# EAGLE design ThermalCamera (EAGLE 9.6.2)
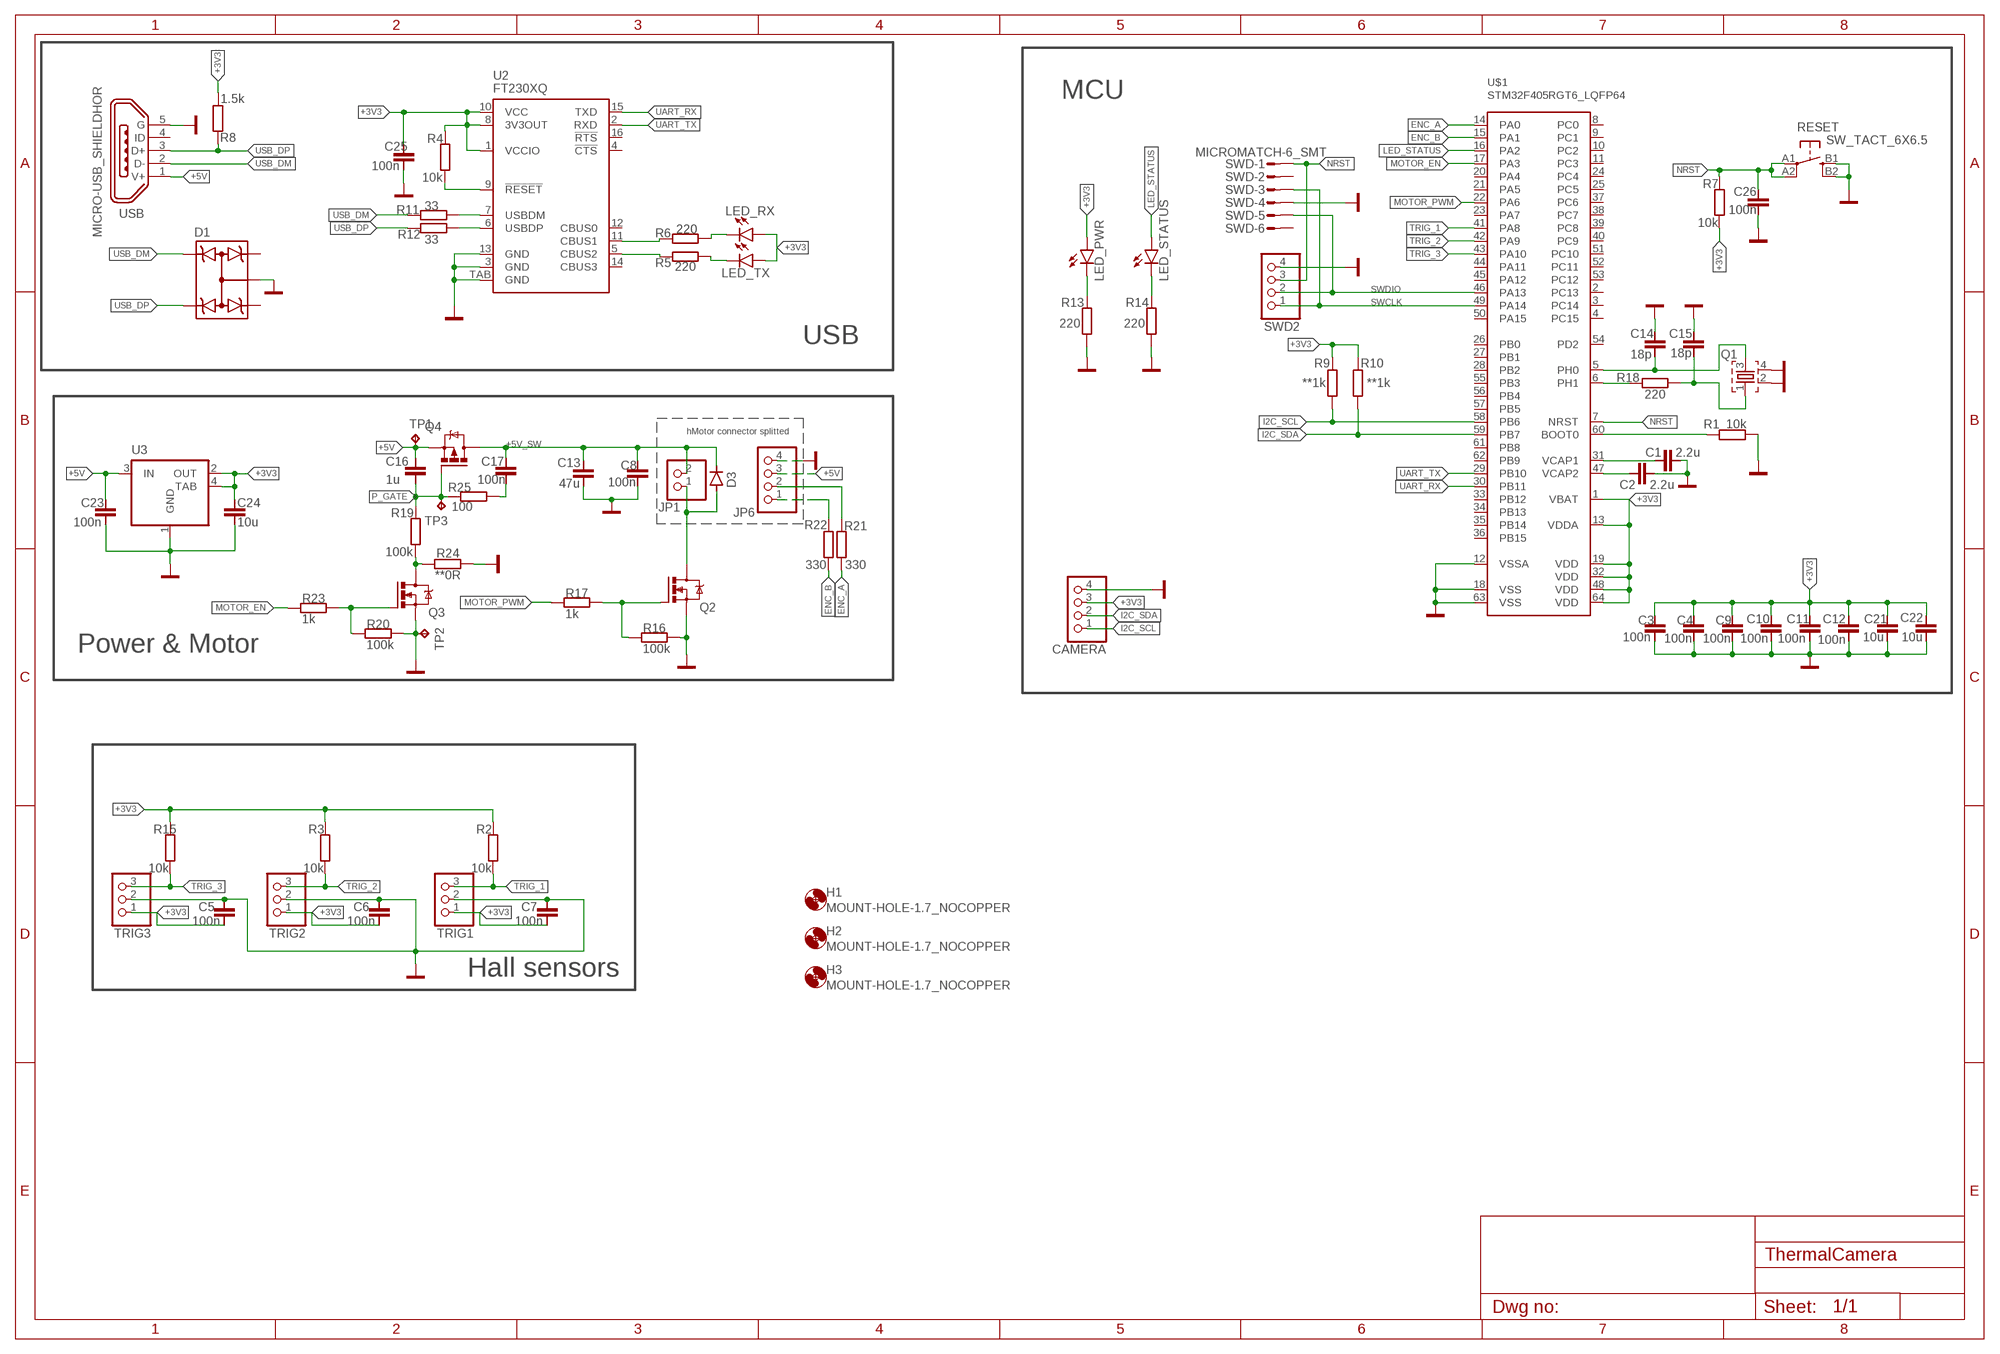
[diagram p0: schematic, sheet 1]

## Parts
C1  2.2u  CAP_H-0603  [0603]
C2  2.2u  CAP_H-0603  [0603]
C3  100n  CAP_H-0603  [0603]
C4  100n  CAP_H-0603  [0603]
C5  100n  CAP_H-0603  [0603]
C6  100n  CAP_H-0603  [0603]
C7  100n  CAP_H-0603  [0603]
C8  100n  CAP_H-0603  [0603]
C9  100n  CAP_H-0603  [0603]
C10  100n  CAP_H-0603  [0603]
C11  100n  CAP_H-0603  [0603]
C12  100n  CAP_H-0603  [0603]
C13  47u  CAP_H-0805  [0805]
C14  18p  CAP_H-0603  [0603]
C15  18p  CAP_H-0603  [0603]
C16  1u  CAP_H-0603  [0603]
C17  100n  CAP_H-0603  [0603]
C21  10u  CAP_H-0603  [0603]
C22  10u  CAP_H-0603  [0603]
C23  100n  CAP_H-0603  [0603]
C24  10u  CAP_H-0603  [0603]
C25  100n  CAP_H-0603  [0603]
C26  100n  CAP_H-0603  [0603]
CAMERA  PINHD-1X4  [1X04]
D1  TRANSIL-4  [SOT323-5]
D3  BAR63-03  [SOD323]
H1  MOUNT-HOLE-1.7_NOCOPPER  [1.7-NO_COPPER]
H2  MOUNT-HOLE-1.7_NOCOPPER  [1.7-NO_COPPER]
H3  MOUNT-HOLE-1.7_NOCOPPER  [1.7-NO_COPPER]
JP1  PINHD-1X2  [1X02]
JP6  PINHD-1X4  [1X04]
LED_PWR  LEDCHIPLED_0603  [CHIPLED_0603]
LED_RX  LEDCHIPLED_0603  [CHIPLED_0603]
LED_STATUS  LEDCHIPLED_0603  [CHIPLED_0603]
LED_TX  LEDCHIPLED_0603  [CHIPLED_0603]
Q1  CRYSTAL_4PIN-5X3.2  [CRYSTAL_5X3.2_4PIN]
Q2  NMOS-SOT23  [SOT23]
Q3  NMOS-SOT23  [SOT23]
Q4  PMOS-SOT23  [SOT23]
R1  10k  RES_H-0603  [0603]
R2  10k  RES_H-0603  [0603]
R3  10k  RES_H-0603  [0603]
R4  10k  RES_H-0603  [0603]
R5  220  RES_H-0603  [0603]
R6  220  RES_H-0603  [0603]
R7  10k  RES_H-0603  [0603]
R8  1.5k  RES_H-0603  [0603]
R9  **1k  RES_H-0603  [0603]
R10  **1k  RES_H-0603  [0603]
R11  33  RES_H-0603  [0603]
R12  33  RES_H-0603  [0603]
R13  220  RES_H-0603  [0603]
R14  220  RES_H-0603  [0603]
R15  10k  RES_H-0603  [0603]
R16  100k  RES_H-0603  [0603]
R17  1k  RES_H-0603  [0603]
R18  220  RES_H-0603  [0603]
R19  100k  RES_H-0603  [0603]
R20  100k  RES_H-0603  [0603]
R21  330  RES_H-0603  [0603]
R22  330  RES_H-0603  [0603]
R23  1k  RES_H-0603  [0603]
R24  **0R  RES_H-0603  [0603]
R25  100  RES_H-0603  [0603]
RESET  SW_TACT_6X6.5  [SW_TACT_6X6.5]
SWD  MICROMATCH-6_SMT  [MICROMATCH-6_SMT]
SWD2  PINHD-1X4  [1X04]
TP1  TPTP12R  [TP12R]
TP2  TPTP12R  [TP12R]
TP3  TPTP06R  [TP06R]
TRIG1  PINHD-1X3  [1X03]
TRIG2  PINHD-1X3  [1X03]
TRIG3  PINHD-1X3  [1X03]
U2  FT230XQ  [QFN16]
U3  REG1117  [SOT223]
U$1  STM32F405RGT6_LQFP64  STM32F40XXX_LQFP64  [SQFP-S-10X10-64]
USB  MICRO-USB_SHIELDHOR  [MICRO_USB_6_SHIELD]

## Nets
+3V3 [POWER]: C3.1 C4.1 C5.2 C6.2 C7.2 C9.1 C10.1 C11.1 C12.1 C21.1 C22.1 C24.1 C25.1 CAMERA.3 LED_PWR.A LED_RX.A LED_TX.A R2.2 R3.2 R4.2 R7.1 R8.1 R9.2 R10.2 R15.2 TRIG1.1 TRIG2.1 TRIG3.1 U2.1(VCCIO) U2.8(3V3OUT) U2.10(VCC) U3.2(OUT) U3.4(TAB) U$1.1(VBAT) U$1.13(VDDA) U$1.19(VDD) U$1.32(VDD) U$1.48(VDD) U$1.64(VDD)
+5V [POWER]: C16.1 C23.1 JP6.3 Q4.2(S) TP1.TP U3.3(IN) USB.1(V+)
+5V_SW [POWER]: C8.1 C13.1 C17.1 D3.1(C) JP1.2 Q4.3(D)
ENC_A: R21.2 U$1.14(PA0)
ENC_B: R22.1 U$1.15(PA1)
GND: C1.2 C2.2 C3.2 C4.2 C5.1 C6.1 C7.1 C8.2 C9.2 C10.2 C11.2 C12.2 C13.2 C14.1 C15.1 C21.2 C22.2 C23.2 C24.2 C25.2 C26.2 CAMERA.4 D1.2 JP6.4 Q1.2 Q1.4 Q2.2(S) Q3.2(S) R1.2 R13.2 R14.2 R16.1 R20.1 R24.1 RESET.B1(S) RESET.B2(S1) SWD2.4 SWD.P$4 TP2.TP TRIG1.2 TRIG2.2 TRIG3.2 U2.3(GND) U2.13(GND) U2.TAB(GND) U3.1(GND) U$1.12(VSSA) U$1.18(VSS) U$1.63(VSS) USB.5(G)
I2C_SCL: CAMERA.1 R9.1 U$1.58(PB6)
I2C_SDA: CAMERA.2 R10.1 U$1.59(PB7)
LED_STATUS: LED_STATUS.A U$1.16(PA2)
MOTOR_EN: R23.2 U$1.17(PA3)
MOTOR_PWM: R17.2 U$1.22(PA6)
N$1: R1.1 U$1.60(BOOT0)
N$2: C1.1 U$1.31(VCAP1)
N$3: C2.1 U$1.47(VCAP2)
N$4: D3.2(A) JP1.1 Q2.3(D)
N$5: R4.1 U2.9(!RESET)
N$6: R6.2 U2.11(CBUS1)
N$7: R5.2 U2.5(CBUS2)
N$8: LED_RX.C R6.1
N$9: LED_TX.C R5.1
N$11: Q3.3(D) R19.1 R24.2
N$13: R11.1 U2.7(USBDM)
N$14: R12.1 U2.6(USBDP)
N$15: LED_PWR.C R13.1
N$16: LED_STATUS.C R14.1
N$17: Q2.1(G) R16.2 R17.1
N$18: R18.1 U$1.6(PH1)
N$19: C15.2 Q1.1 R18.2
N$21: JP6.2 R21.1
N$22: C17.2 R25.1
N$23: Q3.1(G) R20.2 R23.1
N$24: JP6.1 R22.2
NRST: C26.1 R7.2 RESET.A1(P) RESET.A2(P1) SWD2.3 SWD.P$1 U$1.7(NRST)
OSC_IN: C14.2 Q1.3 U$1.5(PH0)
P_GATE: C16.2 Q4.1(G) R19.2 R25.2 TP3.TP
SWCLK: SWD2.1 SWD.P$3 U$1.49(PA14)
SWDIO: SWD2.2 SWD.P$5 U$1.46(PA13)
TRIG_1: R2.1 TRIG1.3 U$1.41(PA8)
TRIG_2: R3.1 TRIG2.3 U$1.42(PA9)
TRIG_3: R15.1 TRIG3.3 U$1.43(PA10)
UART_RX: U2.15(TXD) U$1.30(PB11)
UART_TX: U2.2(RXD) U$1.29(PB10)
USB_DM: D1.4 R11.2 USB.2(D-)
USB_DP: D1.5 R8.2 R12.2 USB.3(D+)
Unconnected: D1.1 D1.3 SWD.P$2 SWD.P$6 U2.4(!CTS) U2.12(CBUS0) U2.14(CBUS3) U2.16(!RTS) U$1.2(PC13) U$1.3(PC14) U$1.4(PC15) U$1.8(PC0) U$1.9(PC1) U$1.10(PC2) U$1.11(PC3) U$1.20(PA4) U$1.21(PA5) U$1.23(PA7) U$1.24(PC4) U$1.25(PC5) U$1.26(PB0) U$1.27(PB1) U$1.28(PB2) U$1.33(PB12) U$1.34(PB13) U$1.35(PB14) U$1.36(PB15) U$1.37(PC6) U$1.38(PC7) U$1.39(PC8) U$1.40(PC9) U$1.44(PA11) U$1.45(PA12) U$1.50(PA15) U$1.51(PC10) U$1.52(PC11) U$1.53(PC12) U$1.54(PD2) U$1.55(PB3) U$1.56(PB4) U$1.57(PB5) U$1.61(PB8) U$1.62(PB9) USB.4(ID) USB.M1(S1) USB.M2(S2) USB.M3(S3) USB.M4(S4) USB.M5(S5) USB.M6(S6)

## Notes on the sheet
- MCU
- USB
- hMotor connector splitted
- Power & Motor
- Hall sensors

## Library data of the parts
C1-C17 C21-C26 = hsrn_rcl:CAP_H
CAMERA JP6 = pinhead:PINHD-1X4: PIN HEADER; SPICEPREFIX: E
D1 = hsrn_diody:TRANSIL-4
D3 = hsrn_diody:BAR63-03: DIODE controlled avalanche rectifier
H1-H3 = hsrn_pads+holes:MOUNT-HOLE
JP1 = pinhead:PINHD-1X2: PIN HEADER
LED_PWR LED_RX LED_STATUS LED_TX = hsrn_diody:LED: LED OSRAM: - CHIPLED LG R971, LG N971, LY N971, LG Q971, LY Q971, LO R971, LY R971 LH N974, LH R974 LS Q976, LO Q976, LY Q976 LO Q996 - Hyper CHIPLED LW Q18S LB Q993, LB Q99A, LB R99A - SideLED LS A670, LO A670, LY A670, LG A670, LP A670 LB A673, LV A673, LT A673, LW A673 LH A674 LY A675 LS A676, LA A676, LO A676, LY A676, LW A676 LS A679, LY A679, LG A679 - Hyper Micro SIDELED® LS Y876, LA Y876, LO Y876, LY Y876 LT Y87S - SmartLED LW L88C, LW L88S LB L89C, LB L89S, LG L890 LS L89K, LO L89K, LY L89K LS L896, LA L896, LO L896, LY L896 - TOPLED LS T670, LO T670, LY T670, LG T670, LP T670 LSG T670, LSP T670, LSY T670, LOP T670, LYG T670 LG T671, LOG T671, LSG T671 LB T673, LV T673, LT T673, LW T673 LH T674 LS T676, LA T676, LO T676, LY T676, LB T676, LH T676, LSB T676, LW T676 LB T67C, LV T67C, LT T67C, LS T67K, LO T67K, LY T67K, LW E67C LS E67B, LA E67B, LO E67B, LY E67B, LB E67C, LV E67C, LT E67C LW T67C LS T679, LY T679, LG T679 LS T770, LO T770, LY T770, LG T770, LP T770 LB T773, LV T773, LT T773, LW T773 LH T774 LS E675, LA E675, LY E675, LS T675 LS T776, LA T776, LO T776, LY T776, LB T776 LHGB T686 LT T68C, LB T68C - Hyper Mini TOPLED® LB M676 - Mini TOPLED Santana® LG M470 LS M47K, LO M47K, LY M47K Source: http://www.osram.convergy.de LUXEON: - LUMILED® LXK2-PW12-R00, LXK2-PW12-S00, LXK2-PW14-U00, LXK2-PW14-V00 LXK2-PM12-R00, LXK2-PM12-S00, LXK2-PM14-U00 LXK2-PE12-Q00, LXK2-PE12-R00, LXK2-PE12-S00, LXK2-PE14-T00, LXK2-PE14-U00 LXK2-PB12-K00, LXK2-PB12-L00, LXK2-PB12-M00, LXK2-PB14-N00, LXK2-PB14-P00, LXK2-PB14-Q00 LXK2-PR12-L00, LXK2-PR12-M00, LXK2-PR14-Q00, LXK2-PR14-R00 LXK2-PD12-Q00, LXK2-PD12-R00, LXK2-PD12-S00 LXK2-PH12-R00, LXK2-PH12-S00 LXK2-PL12-P00, LXK2-PL12-Q00, LXK2-PL12-R00 Source: www.luxeon.com KINGBRIGHT: KA-3528ASYC Source: www.kingbright.com
Q1 = hsrn_pasywne:CRYSTAL_4PIN
Q2 Q3 = hsrn_tranzystory_scr:NMOS
Q4 = hsrn_tranzystory_scr:PMOS
R1-R25 = hsrn_rcl:RES_H
RESET = hsrn_switche:SW_TACT_6X6.5
SWD = hsrn_zlacza_idc:MICROMATCH-6: MicroMaTch 6 7-215464-6 / 0-215464-6 Drawing Number C-215464 DDEController.pdf
SWD2 = pinhead:PINHD-1X4: PIN HEADER
TP1-TP3 = hsrn_pads+holes:TP: Test pad
TRIG1-TRIG3 = pinhead:PINHD-1X3: PIN HEADER
U2 = hsrn_IC_digital:FT230X: USB to BASIC UART IC Auto generated by make-symbol-device-package-bsdl.ulp Rev. 43 Source: Data sheet <http://www.ftdichip.com/Support/Documents/DataSheets/ICs/DS_FT230X.pdf>
U3 = hsrn_IC_power_mgmt:REG1117: 800mA and 1A Low Dropout (LDO) Positive Regulator 1.8V, 2.5V, 2.85V, 3.3V, 5V, and Adj; MPN: REG1117; OC_FARNELL: 1097566; OC_NEWARK: 14P6981
U$1 = hsrn_stm32:STM32F40XXX_LQFP64
USB = hsrn_zlacza:MICRO-USB_SHIELD: Micro USB connector with shield connection.

## Board
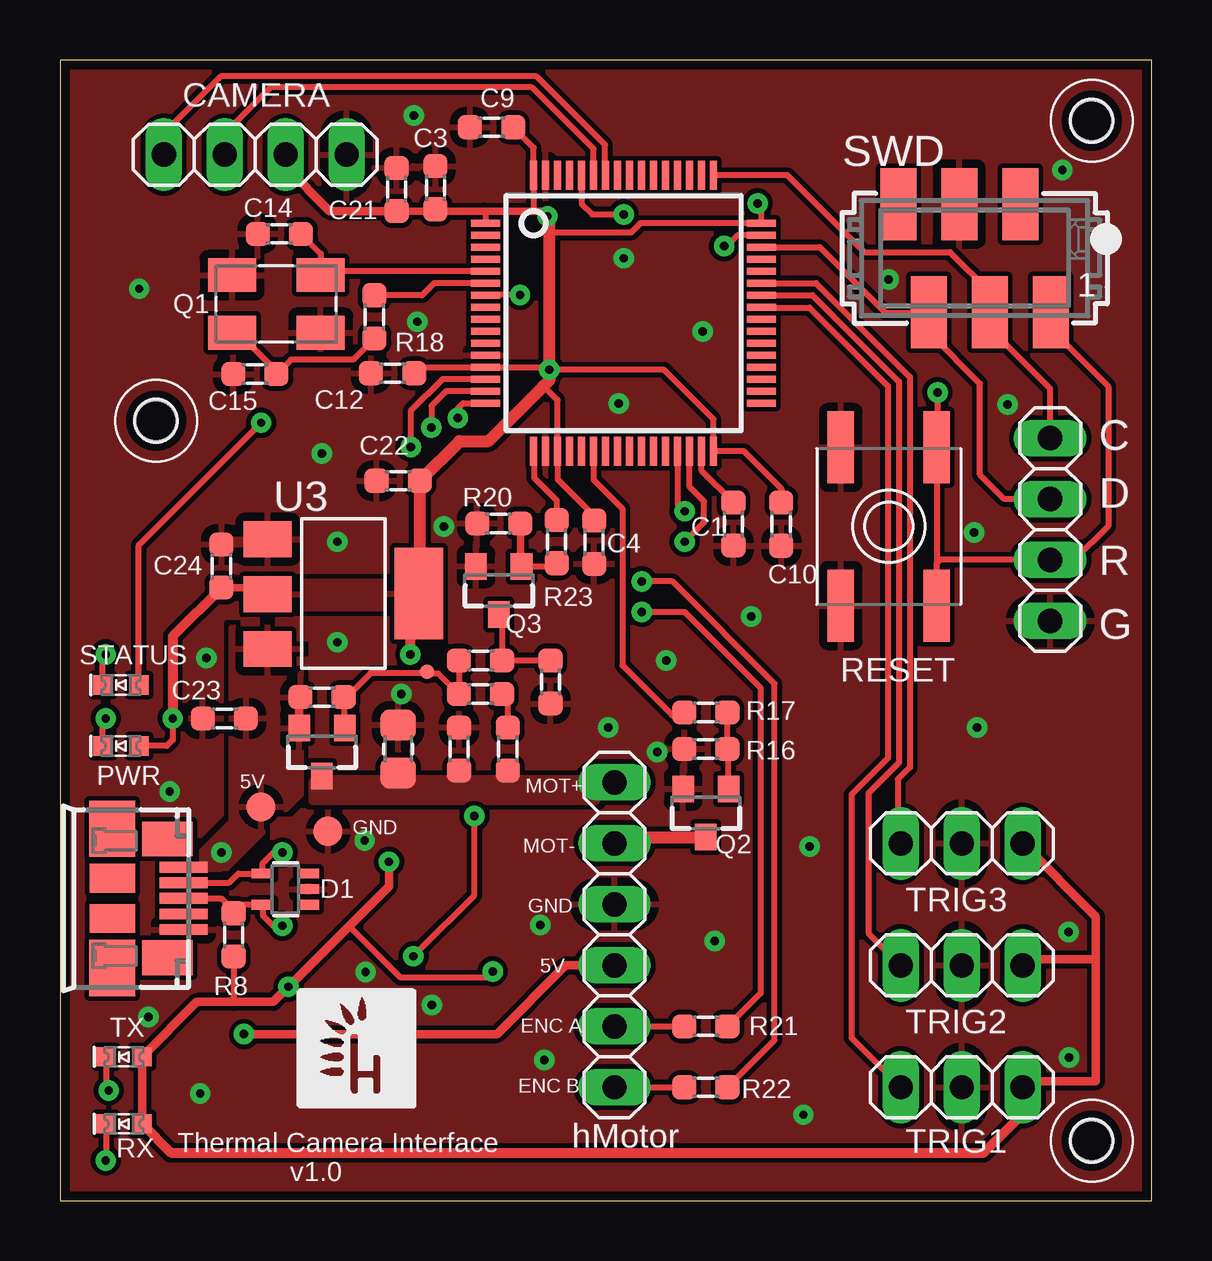
[diagram p1: board, top side]
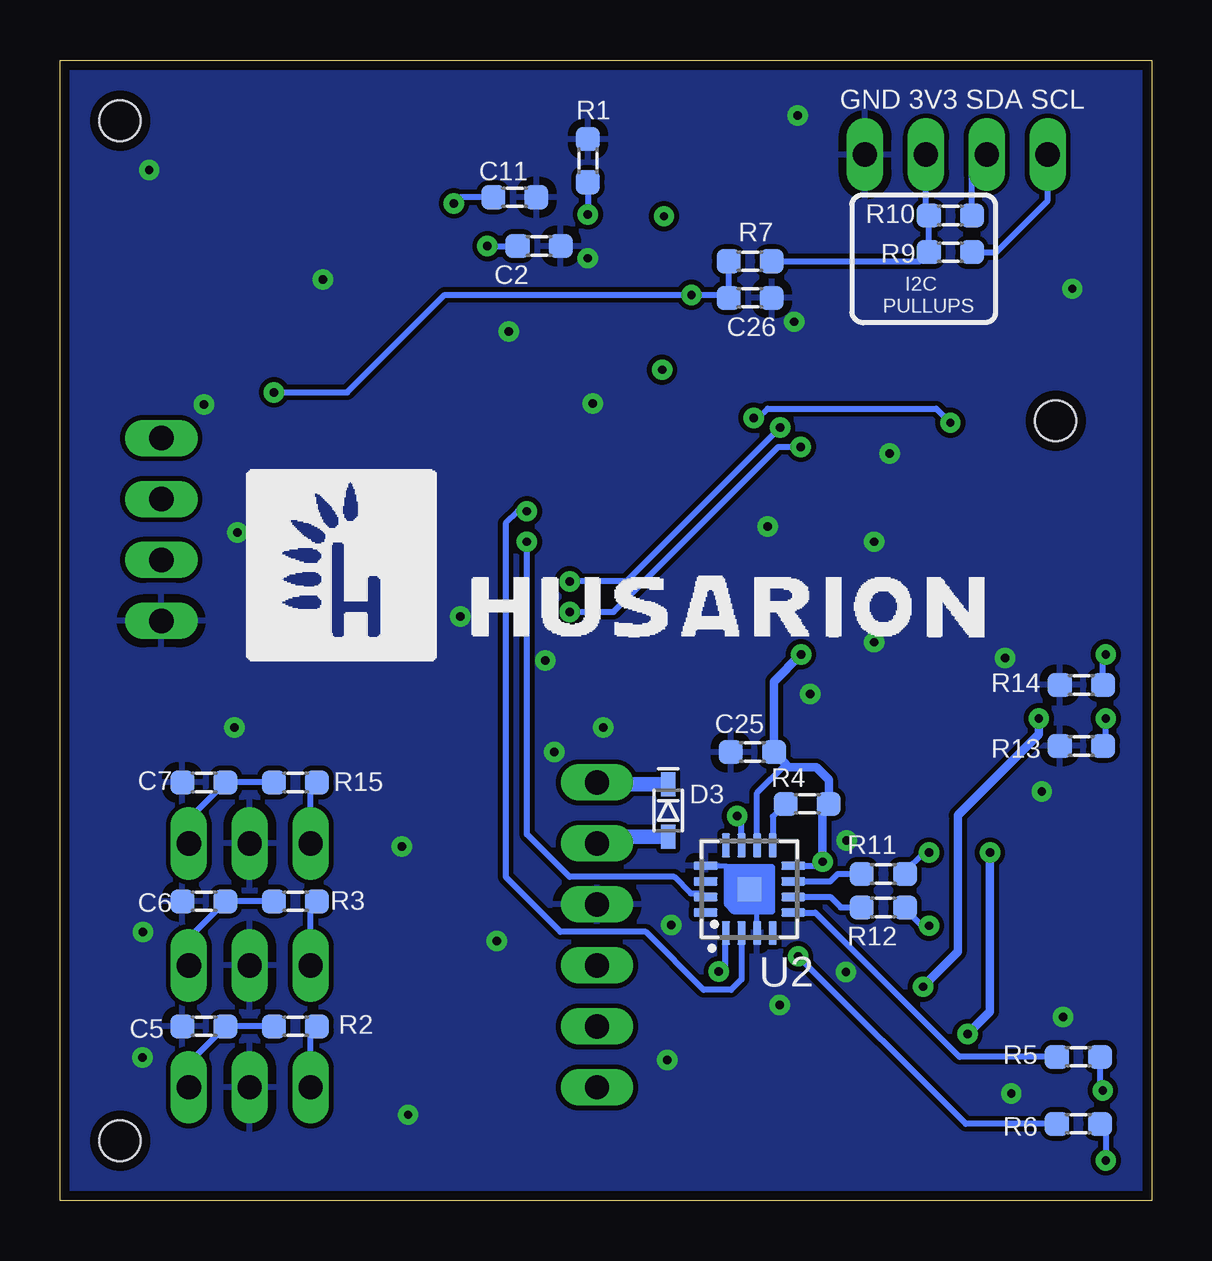
[diagram p2: board, bottom side, seen from below]

Size 45.5 x 47.53 mm. Coordinates in mm from the lower left corner, seen from the top.
Outline: 0,0 45.5,0 45.5,47.53 0,47.53 0,0
Copper layers (1*16): Top 0.035mm / dielectric 1.45mm / Bottom 0.035mm
Design rules "hsrn_2-layer-35um-cost-effective": minimum track width 0.2mm, minimum drill 0.35mm, track to track 0.2mm, track to pad 0.2mm, pad to pad 0.2mm, via to via 0.2mm, smd to smd 0.2mm, copper to edge 0.4mm, drill to drill 0.3mm, minimum pad ring 0.25mm, minimum via ring 0.25mm, stop-mask expansion 0.1mm, vias tented up to drill 0.4mm, thermal gap 0.35mm

### Footprints (pad centres in the part's own frame; a part is rotated, then mirrored left to right if it is on the bottom)
0603 = smd 1 x 1: 1 -0.9,0; 2 0.9,0
0805 = smd 1.3 x 1.5: 1 -1,0; 2 1,0
1X04 = drill 1.016 long: 1 -3.81,0; 2 -1.27,0; 3 1.27,0; 4 3.81,0
SOT323-5 = smd 0.4 x 0.9: 1 -0.65,-0.95; 2 0,-0.95; 3 0.65,-0.95; 4 0.65,0.95; 5 -0.65,0.95
SOD323 = smd 1 x 0.6: 1 -1.1,0; 2 1.1,0
1.7-NO_COPPER = hole 1.7: 0,0
1X02 = drill 1.016 long: 1 -1.27,0; 2 1.27,0
CHIPLED_0603 = smd 0.8 x 0.8: A 0,-0.75; C 0,0.75
CRYSTAL_5X3.2_4PIN = smd 2 x 1.4: 1 -1.85,-1.2; 2 1.85,-1.2; 3 1.85,1.2; 4 -1.85,1.2
SOT23 = smd 0.9 x 1.1: 1 -0.95,-1; 2 0.95,-1; 3 0,1
SW_TACT_6X6.5 = smd 3 x 1.1: A1 -3.3,2; A2 3.3,2; B1 -3.3,-2; B2 3.3,-2
MICROMATCH-6_SMT = smd 1.5 x 3: P$1 3.195,-2.25; P$2 1.925,2.25; P$3 0.655,-2.25; P$4 -0.615,2.25; P$5 -1.885,-2.25; P$6 -3.155,2.25
TP12R = smd 1.2 x 1.2: TP 0,0
TP06R = smd 0.6 x 0.6: TP 0,0
1X03 = drill 1.016 long: 1 -2.54,0; 2 0,0; 3 2.54,0
QFN16 = smd 1 x 0.35: 1 -1.825,0.975; 2 -1.825,0.325; 3 -1.825,-0.325; 4 -1.825,-0.975; 9 1.825,-0.975; 10 1.825,-0.325; 11 1.825,0.325; 12 1.825,0.975 | smd 0.35 x 1: 5 -0.975,-1.825; 6 -0.325,-1.825; 7 0.325,-1.825; 8 0.975,-1.825; 13 0.975,1.825; 14 0.325,1.825; 15 -0.325,1.825; 16 -0.975,1.825 | smd 1 x 1: TAB 0,0
SOT223 = smd 1.499 x 2.007: 1 -2.261,-3.15; 2 0.025,-3.15; 3 2.311,-3.15 | smd 3.81 x 2.007: 4 0,3.15
SQFP-S-10X10-64 = smd 0.3 x 1.2: 1 -3.75,-5.75; 2 -3.25,-5.75; 3 -2.75,-5.75; 4 -2.25,-5.75; 5 -1.75,-5.75; 6 -1.25,-5.75; 7 -0.75,-5.75; 8 -0.25,-5.75; 9 0.25,-5.75; 10 0.75,-5.75; 11 1.25,-5.75; 12 1.75,-5.75; 13 2.25,-5.75; 14 2.75,-5.75; 15 3.25,-5.75; 16 3.75,-5.75; 33 3.75,5.75; 34 3.25,5.75; 35 2.75,5.75; 36 2.25,5.75; 37 1.75,5.75; 38 1.25,5.75; 39 0.75,5.75; 40 0.25,5.75; 41 -0.25,5.75; 42 -0.75,5.75; 43 -1.25,5.75; 44 -1.75,5.75; 45 -2.25,5.75; 46 -2.75,5.75; 47 -3.25,5.75; 48 -3.75,5.75 | smd 1.2 x 0.3: 17 5.75,-3.75; 18 5.75,-3.25; 19 5.75,-2.75; 20 5.75,-2.25; 21 5.75,-1.75; 22 5.75,-1.25; 23 5.75,-0.75; 24 5.75,-0.25; 25 5.75,0.25; 26 5.75,0.75; 27 5.75,1.25; 28 5.75,1.75; 29 5.75,2.25; 30 5.75,2.75; 31 5.75,3.25; 32 5.75,3.75; 49 -5.75,3.75; 50 -5.75,3.25; 51 -5.75,2.75; 52 -5.75,2.25; 53 -5.75,1.75; 54 -5.75,1.25; 55 -5.75,0.75; 56 -5.75,0.25; 57 -5.75,-0.25; 58 -5.75,-0.75; 59 -5.75,-1.25; 60 -5.75,-1.75; 61 -5.75,-2.25; 62 -5.75,-2.75; 63 -5.75,-3.25; 64 -5.75,-3.75
MICRO_USB_6_SHIELD = smd 2 x 0.45: 1 1.975,1.3; 2 1.975,0.65; 3 1.975,0; 4 1.975,-0.65; 5 1.975,-1.3 | smd 2.1 x 1.45: M1 1.3,2.475; M2 1.3,-2.475 | smd 1.9 x 2.35: M3 -1,2.9; M6 -1,-2.9 | smd 1.9 x 1.2: M4 -0.988,0.838; M5 -0.988,-0.838

### Placement (x,y rotation side)
C1  28.07,28.19 270 top
C2  25.53,39.78 0 bottom
C3  15.65,42.21 90 top
C4  22.26,27.44 270 top
C5  39.5,7.27 0 bottom
C6  39.5,12.47 0 bottom
C7  39.5,17.43 0 bottom
C8  16.64,18.82 90 top
C9  17.99,44.73 180 top
C10  30.07,28.19 270 top
C11  26.54,41.81 0 bottom
C12  13.86,34.48 180 top
C13  14.1,18.82 90 top
C14  9.14,40.29 0 top
C15  8.13,34.44 0 top
C16  10.92,20.98 0 top
C17  18.67,18.82 90 top
C21  14.03,42.14 90 top
C22  14.1,30 180 top
C23  6.86,20.09 180 top
C24  6.73,26.44 90 top
C25  16.64,18.7 180 bottom
C26  16.73,37.62 0 bottom
CAMERA  8.14,43.59 0 top
D1  9.4,12.98 90 top
D3  20.15,16.26 270 bottom
H1  43,2.5 0 top
H2  4,32.5 0 top
H3  43,45 0 top
JP1  23.11,16.16 90 top
JP6  23.11,8.54 90 top
LED_PWR  2.54,18.95 90 top
LED_RX  2.67,3.2 90 top
LED_STATUS  2.54,21.49 90 top
LED_TX  2.67,6 90 top
Q1  9.02,37.37 0 top
Q2  26.92,16.16 180 top
Q3  18.29,25.43 180 top
Q4  10.92,18.7 180 top
R1  23.5,43.33 90 bottom
R2  35.69,7.27 180 bottom
R3  35.69,12.47 180 bottom
R4  14.35,16.54 0 bottom
R5  3.05,6 180 bottom
R6  3.05,3.2 180 bottom
R7  16.73,39.14 180 bottom
R8  7.24,11.08 90 top
R9  8.38,39.52 180 bottom
R10  8.38,41.05 180 bottom
R11  11.18,13.62 0 bottom
R12  11.18,12.22 0 bottom
R13  2.92,18.95 180 bottom
R14  2.92,21.49 180 bottom
R15  35.69,17.43 180 bottom
R16  26.92,18.82 0 top
R17  26.92,20.35 180 top
R18  13.11,36.83 270 top
R19  17.53,22.51 180 top
R20  18.29,28.22 0 top
R21  26.92,7.27 0 top
R22  26.92,4.73 180 top
R23  20.7,27.46 90 top
R24  20.45,21.62 90 top
R25  17.53,21.11 180 top
RESET  34.54,28.09 270 top
SWD  38.1,39.27 0 top
SWD2  41.27,27.97 270 top
TP1  8.38,16.41 0 top
TP2  11.18,15.39 0 top
TP3  15.3,22.04 0 top
TRIG1  37.59,4.73 180 top
TRIG2  37.59,9.81 180 top
TRIG3  37.59,14.89 180 top
U2  16.76,12.98 90 bottom
U3  11.81,25.3 270 top
U$1  23.5,36.98 270 top
U$2  [HUSARION_SYGNET_5MM]  12.43,6.4 0 top
U$3  [HUS_NAPIS_BOK_8MM]  37.72,22.51 0 bottom
USB  3.17,12.6 0 top

### Tracks (layer width: path | path; a pad name or v marks a point on that pad's centre or on a via)
+3V3  (via drill 0.35)
  Top 0.254: v18.03,9.55 17.78,9.3 14.2,9.3 12.05,11.45 | v29.08,41.56 29.25,41.39 U$1.48 24.2,40.73 23.81,40.34 20.54,40.34 20.4,40.2 | R8.1 7.24,8.28 | C9.1 19.75,43.88 U$1.64 19.75,41.28 19.7,41.24 | C10.1 30.07,29.67 28.5,31.23 U$1.32 27.25,32.55 25.18,34.62 v20.4,34.62 | 17.68,41.24 17.75,41.17 U$1.1 | C4.1 22.26,28.54 20.75,30.06 U$1.19 20.75,33.35 20.16,33.94 | C12.1 15.02,34.73 U$1.13 20.36,34.73 20.4,34.7 | v4.7,20.09 4.7,19.2 4.45,18.95 LED_PWR.A
  Top 0.305: C24.1 8.39,25.54 U3.2 | C21.1 15.58,41.24 17.68,41.24 19.7,41.24 20.1,41.24 v20.32,41.02
  Top 0.356: CAMERA.3 9.41,43.07 11.24,41.24 C21.1 | TRIG3.1 43.18,11.84 43.18,10.06 | 43.18,10.06 43.18,4.98 40.39,4.98 TRIG1.1 | TRIG2.1 40.39,10.06 43.18,10.06 | LED_RX.A LED_TX.A 5.7,8.28 7.24,8.28 8.89,8.28 v9.53,8.92 12.05,11.45 13.72,13.11 v13.72,14.12
  Top 0.406: 15.58,41.24 C3.1 | v14.61,22.76 14.61,24.94 U3.4 | C24.1 4.7,23.51 v4.7,20.09 | LED_RX.A 4.62,2 38.5,2 40.13,3.63 TRIG1.1
  Top 0.508: v20.32,41.02 20.4,40.94 20.4,40.2 20.4,34.7 v20.4,34.62 20.4,34.19 20.16,33.94 17.86,31.65 16.65,31.65 C22.1 15,25.34 U3.4
  Bottom 0.254: U2.10 16.44,16.99 15.23,18.19 | U2.1 17.78,11.12 17.78,9.81 v18.03,9.55 | v29.08,41.56 28.83,41.81 C11.1 | CAMERA.3 9.41,41.17 R10.2 R9.2 9.66,39.14 R7.1 | R15.2 C7.2 40.13,15.89 TRIG3.1 | R3.2 C6.2 40.13,10.94 TRIG2.1 | R2.2 C5.2 40.13,5.73 TRIG1.1 | U2.8 13.88,13.96 v13.72,14.12
  Bottom 0.356: v4.7,20.09 4.7,19.44 8.08,16.06 8.08,10.37 v9.53,8.92 | v14.61,22.76 15.74,21.63 C25.1 15.23,18.19 15.1,18.06 13.97,18.06 13.45,17.54 R4.2 13.72,16.27 v13.72,14.12
  pour Top: 9.53,25.81 14.22,25.81 14.22,24.66 9.53,24.66 9.4,24.79 9.4,25.68
+5V  (via drill 0.35)
  Top 0.356: v7.67,6.94 18.21,6.94 21.08,9.81 JP6.3 | Q4.2 9.97,20.93 C16.1
  Bottom 0.356: v6.73,14.51 6.73,7.88 v7.67,6.94
  pour Top: 5.97,14.62 7.17,15.82 7.17,23.9 10.03,23.9 10.03,16.92 6.96,13.84 5.97,13.84
  pour Top (no thermals): 5.9,13.8 5.9,14.6 6.4,14.6 6.7,14.3 6.7,13.8
+5V_SW
  Bottom 0.61: D3.1 23.04,17.36 JP1.2
  pour Top (no thermals): 10.54,17.43 10.54,16.66 22.35,16.66 22.35,18.06 21.84,17.55 10.67,17.55
ENC_A  (via drill 0.35)
  Top 0.254: U$1.14 15.95,34.23 14.62,32.91 v14.62,31.41 | R21.2 29.2,8.64 29.2,21.37 26.04,24.54 v24.26,24.54
  Bottom 0.254: v24.26,24.54 22.42,24.54 15.55,31.41 v14.62,31.41
ENC_B  (via drill 0.35)
  Top 0.254: U$1.15 16.1,33.73 15.49,33.12 v15.49,32.22 | R22.1 29.79,6.69 29.79,21.55 25.53,25.81 v24.26,25.81
  Bottom 0.254: v15.49,32.22 21.89,25.81 v24.26,25.81
GND  (via drill 0.35)
  Bottom 0.2: U2.13 17.74,13.96 U2.TAB 16.44,12.66 U2.3
  other vias: 24.89,18.7 22.86,19.71 25.27,22.51 23.5,39.27 26.8,36.22 38.1,27.84 39.5,33.17 30.99,3.58 20.19,5.87 15.49,8.16 12.74,9.54 5.84,4.47 4.57,17.05 6.1,22.62 11.56,27.46 10.92,31.14 27.3,10.81 31.24,14.76 38.23,19.71 42.06,5.97 42.04,11.2 41.78,42.95 14.76,45.22 3.3,38 28.81,24.34 3.68,7.65 16,28.09 34.54,38.38 14.22,21.11 11.56,23.27 12.7,15.01 20.02,11.49 14.9,36.62 23.3,33.22
  pour Top (rank 2): 0.13,47.78 45.59,47.78 45.72,47.65 45.72,0 0.13,0
  pour Bottom: 0,-0.1 0,47.65 0.25,47.91 45.85,47.91 45.85,0.15 45.72,0.03 0.13,0.03
I2C_SCL
  Top 0.254: U$1.58 22.73,42.75 22.73,43.99 19.86,46.85 6.69,46.85 4.33,44.48 CAMERA.1
  Bottom 0.254: R9.1 6.47,39.52 4.33,41.67 CAMERA.1
I2C_SDA
  Top 0.254: U$1.59 22.25,43.82 19.67,46.39 8.77,46.39 6.87,44.48 CAMERA.2
  Bottom 0.254: R10.1 7.48,42.97 CAMERA.2
LED_STATUS  (via drill 0.35)
  Top 0.254: v16.59,32.62 16.59,33.02 16.8,33.23 U$1.16 | v8.39,32.42 3.29,27.32 LED_STATUS.A
  Bottom 0.254: v16.59,32.62 16.38,32.62 16,33 8.97,33 v8.39,32.42
MOTOR_EN
  Top 0.254: U$1.17 19.77,31.21 19.77,30.12 20.7,29.18 R23.2
MOTOR_PWM
  Top 0.254: U$1.22 22.25,30.03 23.45,28.83 23.45,22.3 25.53,20.22 25.9,20.22 R17.2
N$1  (via drill 0.35)
  Top 0.254: U$1.60 21.75,41.53 22.18,41.09 v23.5,41.09
  Bottom 0.254: R1.1 v23.5,41.09
N$2
  Top 0.254: C1.1 26.75,30.42 U$1.31
N$3  (via drill 0.35)
  Top 0.254: U$1.47 28.27,40.23 27.81,39.78 v27.69,39.78
  Bottom 0.254: v27.69,39.78 C2.1
N$4
  Top 0.508: JP1.1 23.37,15.14 26.91,15.14 Q2.3
  Bottom 0.61: D3.2 22.84,15.16 JP1.1
N$5
  Bottom 0.254: R4.1 15.79,16 U2.9
N$6  (via drill 0.35)
  Top 0.254: v14.73,10.19 14.93,10.38 14.93,10.39 17.27,12.73 v17.27,16.03
  Bottom 0.254: v14.73,10.19 7.75,3.2 R6.2 | U2.11 17.09,15.85 v17.27,16.03
N$7
  Bottom 0.254: R5.2 8,6 14.01,12.01 U2.5
N$8  (via drill 0.35)
  Top 0.254: LED_RX.C v1.92,1.69 v1.91,1.68
  Bottom 0.254: R6.1 1.91,2.96 v1.91,1.68
N$9  (via drill 0.35)
  Top 0.254: LED_TX.C 1.92,4.71 v2.03,4.6
  Bottom 0.254: R5.1 2.15,4.71 v2.03,4.6
N$11
  Top 0.254: Q3.3 18.43,24.29 R19.1 R24.2
N$13
  Bottom 0.254: U2.7 13.39,13.31 13.08,13.62 R11.1
N$14
  Bottom 0.254: U2.6 13.39,12.66 12.95,12.22 R12.1
N$15  (via drill 0.35)
  Top 0.254: LED_PWR.C 1.79,19.98 v1.91,20.09
  Bottom 0.254: R13.1 1.91,19.07 v1.91,20.09
N$16  (via drill 0.35)
  Top 0.254: LED_STATUS.C 1.79,22.65 v1.91,22.76
  Bottom 0.254: R14.1 2.02,22.64 v1.91,22.76
N$17
  Top 0.254: Q2.1 27.87,18.77 R16.2 R17.1
N$18
  Top 0.254: U$1.6 15.6,38.23 15.09,37.72 R18.1
N$19
  Top 0.254: Q1.1 7.42,36.16 9.03,34.56 C15.2 9.63,35.04 12.22,35.04 R18.2
N$21
  Top 0.254: JP6.2 R21.1
N$22
  Top 0.254: C17.2 18.67,20.74 18.43,20.98 R25.1
N$23
  Top 0.254: Q3.1 20.57,26.43 R23.1
  Top 0.305: Q3.1 19.19,26.48 R20.2
N$24
  Top 0.254: JP6.1 R22.2
NRST  (via drill 0.35)
  Top 0.254: v19.18,37.75 17.76,37.75 U$1.7 | RESET.A2 36.54,26.57 | 36.54,26.57 36.67,26.7 SWD2.3 42.29,26.7 43.69,28.09 43.69,33.94 41.3,36.33 SWD.P$1 | v36.58,33.68 36.58,31.43 RESET.A1 36.54,26.57
  Bottom 0.254: v36.58,33.68 33.53,33.68 29.46,37.75 v19.18,37.75 17.76,37.75 C26.1 R7.2
OSC_IN
  Top 0.254: 10.87,38.8 10.87,39.46 C14.2 | 10.87,38.8 Q1.3 | U$1.5 10.93,38.73 10.87,38.8
P_GATE
  Top 0.254: R19.2 R25.2 15.77,21.97 15.38,21.97 TP3.TP 15.24,21.98 12.94,21.98 11.94,20.98 | 11.94,20.98 C16.2 | Q4.1 11.87,20.92 11.94,20.98
SWCLK
  Top 0.254: U$1.49 30.32,42.73 33.53,39.52 37.1,39.52 38.76,37.87 SWD.P$3 38.76,36.35 41.27,33.83 SWD2.1
SWDIO
  Top 0.2: 36.3,36.1 36.22,36.19 36.22,37 SWD.P$5
  Top 0.254: SWD2.2 39.37,29.24 38.35,30.25 38.35,34.05 36.3,36.1 | U$1.46 31.67,39.73 34.4,37 36.22,37
TRIG_1
  Top 0.254: U$1.41 29.27,37.21 31.24,37.21 34.52,33.94 34.52,18.44 32.99,16.92 32.99,6.78 TRIG1.3
  Bottom 0.254: TRIG1.3 35.05,7 R2.1
TRIG_2
  Top 0.254: U$1.42 31.37,37.73 34.98,34.13 34.98,18.25 33.71,16.98 33.71,11.15 TRIG2.3
  Bottom 0.254: TRIG2.3 35.05,12.21 R3.1
TRIG_3
  Top 0.254: U$1.43 31.52,38.23 35.43,34.32 35.43,18.06 34.92,17.55 34.92,15.01 TRIG3.3
  Bottom 0.254: TRIG3.3 35.05,17.16 R15.1
UART_RX  (via drill 0.35)
  Top 0.254: U$1.30 26.25,29.74 26.84,29.14 26.84,28.27 v26.04,27.46
  Bottom 0.254: U2.15 18.73,12.8 19.2,12.8 19.89,13.49 24.26,13.49 26.04,15.27 v26.04,27.46
UART_TX  (via drill 0.35)
  Top 0.254: U$1.29 25.75,29.02 v26.04,28.73
  Bottom 0.254: U2.2 17.09,9.23 17.53,8.79 18.67,8.79 21.08,11.2 24.64,11.2 26.92,13.49 26.92,28.22 26.42,28.73 v26.04,28.73
USB_DM  (via drill 0.35)
  Top 0.254: v9.27,14.51 8.89,14.51 8.45,14.06 D1.4 7.43,13.63 7.05,13.25 USB.2
  Bottom 0.254: v9.27,14.51 9.47,14.51 10.28,13.7 R11.2
USB_DP  (via drill 0.35)
  Top 0.254: USB.3 6.71,12.6 7.24,12.08 R8.2 7.59,12.33 D1.5 8.45,11.9 8.89,11.46 v9.27,11.46
  Bottom 0.254: R12.2 10.28,12.16 9.57,11.46 v9.27,11.46

### Text on the board
tNames: C | D | R | G | STATUS | PWR | 5V | MOT+ | GND | MOT- | GND | 5V | TX | ENC A | ENC B | hMotor | RX | Thermal Camera Interface / v1.0
bNames: GND 3V3 SDA SCL | I2C / PULLUPS